# Altium schematic sheet Bluetooth_CSR1010.SchDoc: Bluetooth CSR1010
size A4
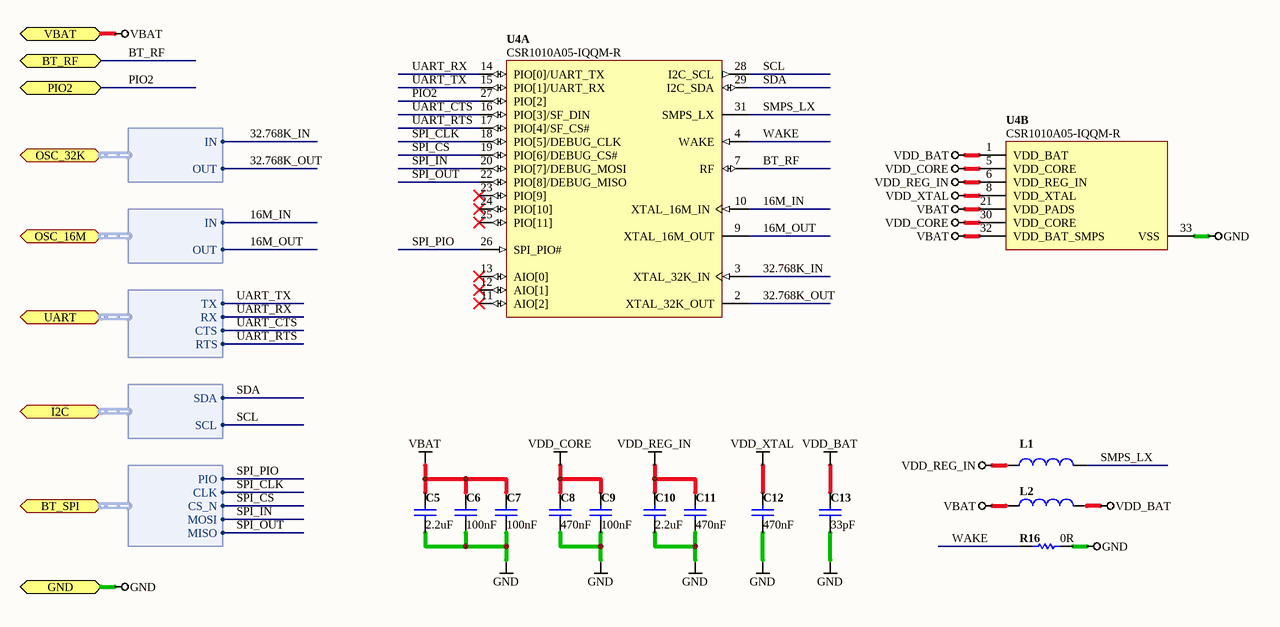
[diagram p0: Bluetooth_CSR1010.SchDoc]

## Parts
C5  value 2.2uF  [CAPC0402(1005)60_N]  (hidden comment: CAP 2.2uF 6.3V 0402(1005))
C6  value 100nF  [CAPC0402(1005)60_N]  (hidden comment: CAP 100nF 6.3V 0402(1005))
C7  value 100nF  [CAPC0402(1005)60_N]  (hidden comment: CAP 100nF 6.3V 0402(1005))
C8  value 470nF  [CAPC0402(1005)60_N]  (hidden comment: CAP 470nF 6.3V 0402(1005))
C9  value 100nF  [CAPC0402(1005)60_N]  (hidden comment: CAP 100nF 6.3V 0402(1005))
C10  value 2.2uF  [CAPC0402(1005)60_N]  (hidden comment: CAP 2.2uF 6.3V 0402(1005))
C11  value 470nF  [CAPC0402(1005)60_N]  (hidden comment: CAP 470nF 6.3V 0402(1005))
C12  value 470nF  [CAPC0402(1005)60_N]  (hidden comment: CAP 470nF 6.3V 0402(1005))
C13  value 33pF  [CAPC0402(1005)60_N]  (hidden comment: CAP 33pF 10V 0402(1005))
L1  7447966  [SMD-0603]  (value not drawn)
L2  MMZ1005Y152CT  [TDK-CHIP-2_V]  (value not drawn)
R16  value 0R  [RESC0402(1005)_N]  (hidden comment: Jumper 0402(1005))
U4  CSR1010A05-IQQM-R  [CSR-CSR1010A05-IQQM-R-QFN32_M]  (parts A,B of 2)

## Ports
BT_RF, BT_SPI (harness SPI_CSR1010), GND, I2C (harness I2C), OSC_16M (harness OSC), OSC_32K (harness OSC), PIO2, UART (harness UART_HS), VBAT

## Harnesses
UART_HS: RX, RTS, TX, CTS
I2C: SCL, SDA
SPI_CSR1010: MISO, CS_N, PIO, MOSI, CLK
OSC: OUT, IN

## Nets
GND: C5.1 C6.1 C7.1 C8.1 C9.1 C10.1 C11.1 C12.1 C13.1 R16.2 U4.33(VSS) ; port GND
VBAT: C5.2 C6.2 C7.2 L2.1 U4.21(VDD_PADS) U4.32(VDD_BAT_SMPS) ; port VBAT
VDD_BAT: C13.2 L2.2 U4.1(VDD_BAT)
VDD_CORE: C8.2 C9.2 U4.5(VDD_CORE) U4.30(VDD_CORE)
VDD_REG_IN: C10.2 C11.2 L1.2 U4.6(VDD_REG_IN)
VDD_XTAL: C12.2 U4.8(VDD_XTAL)
16M_IN: U4.10(XTAL_16M_IN) ; port OSC_16M.IN
16M_OUT: U4.9(XTAL_16M_OUT) ; port OSC_16M.OUT
32.768K_IN: U4.3(XTAL_32K_IN) ; port OSC_32K.IN
32.768K_OUT: U4.2(XTAL_32K_OUT) ; port OSC_32K.OUT
BT_RF: U4.7(RF) ; port BT_RF
PIO2: U4.27(PIO[2]) ; port PIO2
SCL: U4.28(I2C_SCL) ; port I2C.SCL
SDA: U4.29(I2C_SDA) ; port I2C.SDA
SMPS_LX: L1.1 U4.31(SMPS_LX)
SPI_CLK: U4.18(PIO[5]/DEBUG_CLK) ; port BT_SPI.CLK
SPI_CS: U4.19(PIO[6]/DEBUG_CS#) ; port BT_SPI.CS_N
SPI_IN: U4.20(PIO[7]/DEBUG_MOSI) ; port BT_SPI.MOSI
SPI_OUT: U4.22(PIO[8]/DEBUG_MISO) ; port BT_SPI.MISO
SPI_PIO: U4.26(SPI_PIO#) ; port BT_SPI.PIO
UART_CTS: U4.16(PIO[3]/SF_DIN) ; port UART.CTS
UART_RTS: U4.17(PIO[4]/SF_CS#) ; port UART.RTS
UART_RX: U4.14(PIO[0]/UART_TX) ; port UART.RX
UART_TX: U4.15(PIO[1]/UART_RX) ; port UART.TX
WAKE: R16.1 U4.4(WAKE)

Not connected (* = marked no-connect by the designer): U4 11(AIO[2])* 12(AIO[1])* 13(AIO[0])* 23(PIO[9])* 24(PIO[10])* 25(PIO[11])*

## Notes on the sheet
- Sheet Title
- Project Title
- Size:
- Date:
- A4
- Item:
- Time:
- Revision:
- Sheet
- of
- File:

## Library data of the parts
C5 C10 = CMP-1034-02125-1: CAP 2.2uF 6.3V ±10% 0402 (1005 Metric) Thickness 0.6mm SMD; Case-EIA: 0402; Case-Metric: 1005; Rated Voltage: 6.3 V; Max Thickness: 0.6 mm; Tolerance: ±10%; Technology: SMT
C6 C7 C9 = CMP-1034-02060-1: CAP 100nF 6.3V ±5% 0402 (1005 Metric) Thickness 0.6mm SMD; Case-EIA: 0402; Case-Metric: 1005; Rated Voltage: 6.3 V; Max Thickness: 0.6 mm; Tolerance: ±5%; Technology: SMT
C8 C11 C12 = CMP-1034-02103-1: CAP 470nF 6.3V ±10% 0402 (1005 Metric) Thickness 0.6mm SMD; Case-EIA: 0402; Case-Metric: 1005; Rated Voltage: 6.3 V; Max Thickness: 0.6 mm; Tolerance: ±10%; Technology: SMT
C13 = CMP-1034-00985-1: CAP 33pF 10V ±0.5pF 0402 (1005 Metric) Thickness 0.6mm SMD; Case-EIA: 0402; Case-Metric: 1005; Rated Voltage: 10 V; Max Thickness: 0.6 mm; Tolerance: ±0.5pF; Technology: SMT
L1 = CMP-0221-00043-1: SMD-Multilayer Inductor WE-MI, L = 4.70 µH; Inductance: 4.70 µH; ComponentLink2URL: http://www.we-online.de/katalog/media/pdf/7447966.pdf; PackageVersion: 2009; DatasheetVersion: ver 5, Oct-2004; ComponentLink1Description: Manufacturer Link; PackageDescription: Chip Inductor, 2-Leads, Body 1.6 x 0.8 mm; PackageReference: SMD-0603; ComponentLink1URL: http://www.we-online.com; ComponentLink2Description: Datasheet
L2 = CMP-0457-00001-1: Chip Bead for Signal Line, 1500 ohm at 100 MHz, -55 to 125 degC, 1.0 x 1.0 x 0.5 mm SMD; Manufacturer: TDK; Rated Current (mA) max: 100; Tolerance: +/- 25%; DC Resistance (ohm) max: 1; Impedance [100MHz] (ohm): 1500; Operating Temperature: -55 to 125 degC; ComponentLink3Description: Package Specification; Mounting Technology: Surface Mount; ComponentLink2Description: Datasheet; ComponentLink1Description: Manufacturer URL; ComponentLink1URL: http://www.tdk.co.jp; PackageReference: CHIP-2; ComponentLink3URL: https://www.tdk.co.jp/tefe02/e9412_mmz.pdf; PackageDescription: 2-Pin, CHIP, Body 1x0.5mm, Pitch 0.9mm; PartNumber: MMZ1005Y152CT; ComponentLink2URL: https://www.tdk.co.jp/tefe02/e9412_mmz.pdf
R16 = CMP-1011-00001-1: Jumper 0402 (1005 Metric); Tolerance: None; Case-Metric: 1005; Case-EIA: 0402; Power: None; Technology: SMT
U4 = CMP-0450-00001-1: Bluetooth Low Energy Single-mode IC, 64 KB RAM and 64 KB ROM, -30 to 85 degC, 32-pin QFN; Manufacturer: CSR; Stop bits No.: 1 or 2; I/O Supply Voltage (VDD_PADS): 1.2 to 3.6 V; Digital IO No.: 12; Packing: Tape and Reel; Flow control: CTS / RTS; Bits per byte: 8; Baud Rate (max): 2Mbaud (<=1%Error); Baud Rate (min): 1200 baud (<=2%Error); ComponentLink2Description: Datasheet; ComponentLink2URL: https://www.csrsupport.com/download/39359/CSR1010%20Data%20Sheet%20CS-231985-DS.pdf; PartNumber: CSR1010A05-IQQM-R; DatasheetVersion: Rev. 4; Memory Size: 64KB RAM and 64KB ROM; ComponentLink3URL: https://www.csrsupport.com/download/39359/CSR1010%20Data%20Sheet%20CS-231985-DS.pdf; Mounting Technology: Surface Mount; Operating Temperature: -30 to 85 degC; PackageDescription: 32-Pin Quad Flat No-lead Package, Body 5x5mm, Pitch 0.5mm; ComponentLink1URL: http://csr.com/; PackageReference: QFN-32; ComponentLink3Description: Package Specification; ComponentLink1Description: Manufacturer URL